# Altium schematic sheet Power Supply.SchDoc
size A
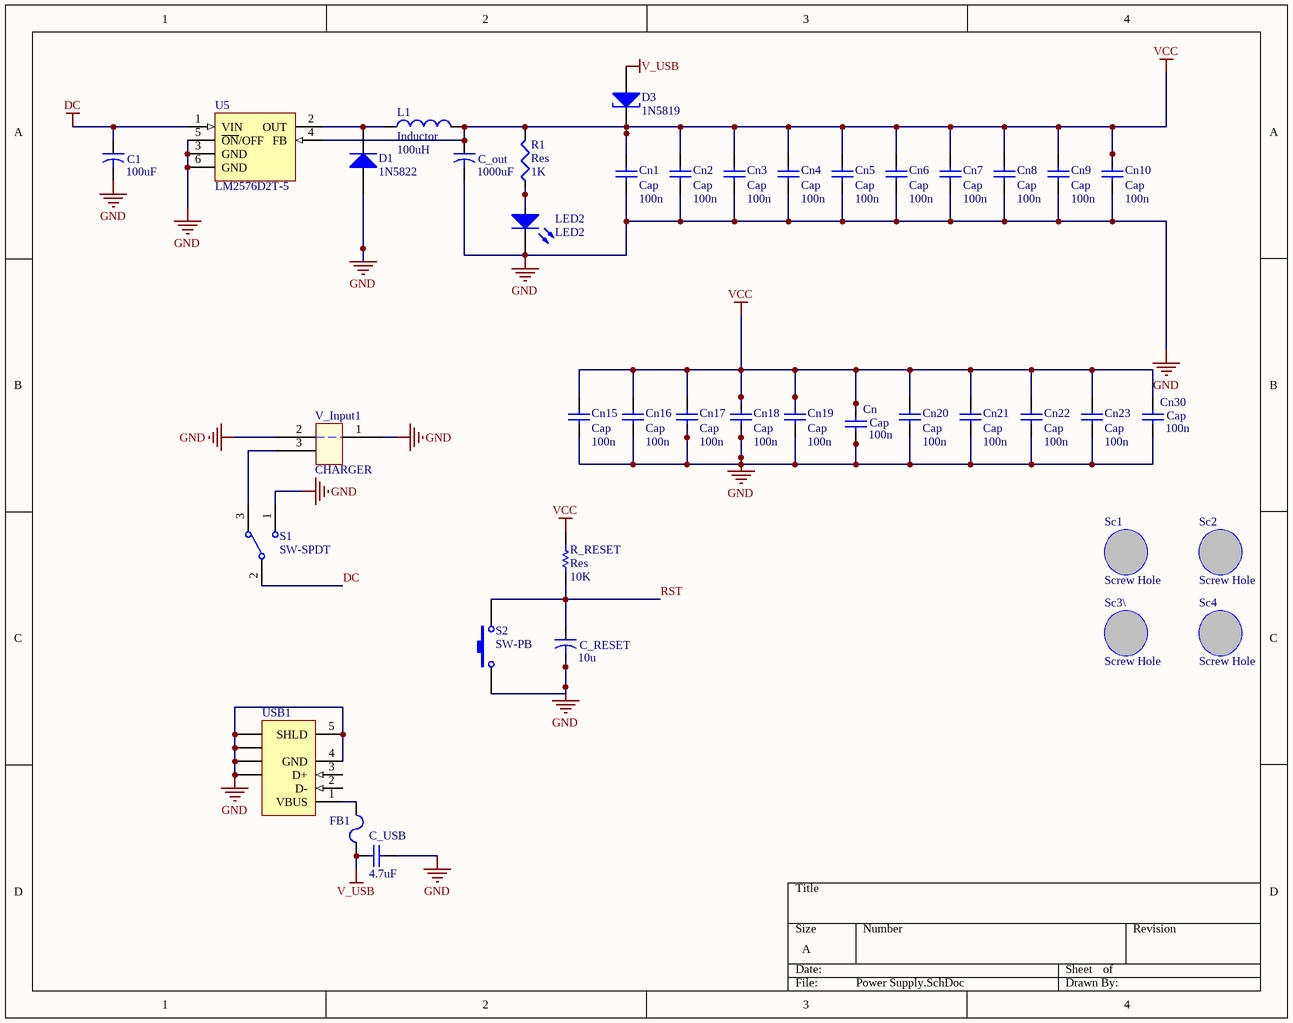
[diagram p0: Power Supply.SchDoc]

## Parts
C1  value 100uF  [CA1.5P]  (hidden comment: Cap_El)
C_out  value 1000uF  [CA1.5P]  (hidden comment: Cap_El)
C_RESET  value 10u  [CA1.5P]  (hidden comment: Cap_El)
C_USB  value 4.7uF  [2012[0805]]  (hidden comment: Cap_UP)
Cn  Cap  value 100n  [1608[0603]]
Cn1  Cap  value 100n  [1608[0603]]
Cn2  Cap  value 100n  [1608[0603]]
Cn3  Cap  value 100n  [1608[0603]]
Cn4  Cap  value 100n  [1608[0603]]
Cn5  Cap  value 100n  [1608[0603]]
Cn6  Cap  value 100n  [1608[0603]]
Cn7  Cap  value 100n  [1608[0603]]
Cn8  Cap  value 100n  [1608[0603]]
Cn9  Cap  value 100n  [1608[0603]]
Cn10  Cap  value 100n  [1608[0603]]
Cn15  Cap  value 100n  [1608[0603]]
Cn16  Cap  value 100n  [1608[0603]]
Cn17  Cap  value 100n  [1608[0603]]
Cn18  Cap  value 100n  [1608[0603]]
Cn19  Cap  value 100n  [1608[0603]]
Cn20  Cap  value 100n  [1608[0603]]
Cn21  Cap  value 100n  [1608[0603]]
Cn22  Cap  value 100n  [1608[0603]]
Cn23  Cap  value 100n  [1608[0603]]
Cn30  Cap  value 100n  [1608[0603]]
D1  1N5822  [US1M]
D3  1N5819  [us1m]
FB1  (no value)  [2012[0805]]
L1  Inductor  value 100uH  [AXIAL-0.3]
LED2  LED2  [3518]
R1  Res  value 1K  [1608[0603]]
R_RESET  Res  value 10K  [1608[0603]]
S1  SW-SPDT  [SW-SPDT]
S2  SW-PB  [SPST-2]
Sc1  Screw Hole  [Screw Holw 3-6 mm]
Sc2  Screw Hole  [Screw Holw 3-6 mm]
Sc3\  Screw Hole  [Screw Holw 3-6 mm]
Sc4  Screw Hole  [Screw Holw 3-6 mm]
U5  LM2576D2T-5  [936A-02]
USB1  (no value)  [USB_Mini]
V_Input1  CHARGER  [CHARGER]

## Nets
DC: C1.1 S1.2 U5.1(VIN)
GND: C1.2 C_out.2 C_RESET.2 C_USB.2 Cn.2 Cn1.1 Cn2.1 Cn3.1 Cn4.1 Cn5.1 Cn6.1 Cn7.1 Cn8.1 Cn9.1 Cn10.1 Cn15.1 Cn16.1 Cn17.1 Cn18.1 Cn19.1 Cn20.1 Cn21.1 Cn22.1 Cn23.1 Cn30.2 D1.1(A) LED2.2(K) S1.1 S2.1 U5.3(GND) U5.5(~{ON}/OFF) U5.6(GND) USB1.4(GND) USB1.5(SHLD) USB1.6(SHLD) USB1.7(SHLD) USB1.8(SHLD) USB1.9(SHLD) V_Input1.1 V_Input1.2
V_USB: C_USB.1 D3.2(A) FB1.2
VCC: C_out.1 Cn.1 Cn1.2 Cn2.2 Cn3.2 Cn4.2 Cn5.2 Cn6.2 Cn7.2 Cn8.2 Cn9.2 Cn10.2 Cn15.2 Cn16.2 Cn17.2 Cn18.2 Cn19.2 Cn20.2 Cn21.2 Cn22.2 Cn23.2 Cn30.1 D3.1(K) L1.2 R1.2 R_RESET.1 U5.4(FB)
RST: C_RESET.1 R_RESET.2 S2.2
NetD1_2: D1.2(K) L1.1 U5.2(OUT)
NetFB1_1: FB1.1 USB1.1(VBUS)
NetLED2_1: LED2.1(A) R1.1
NetS1_3: S1.3 V_Input1.3

Not connected (* = marked no-connect by the designer): USB1 2(D-) 3(D+)

## Library data of the parts
C1 C_out C_RESET = Cap_El: Capacitor; Published: 23-Sep-2002; PackageReference: CAPR5-4X5; Publisher: Altium Limited
C_USB Cn Cn30 = Cap_UP: Capacitor; Published: 8-Jun-2000; LatestRevisionDate: 17-Jul-2002; LatestRevisionNote: Re-released for DXP Platform.; PackageReference: RAD-0.3; Publisher: Altium Limited
Cn1-Cn10 Cn15-Cn23 = Cap: Capacitor; Published: 8-Jun-2000; LatestRevisionDate: 17-Jul-2002; LatestRevisionNote: Re-released for DXP Platform.; PackageReference: RAD-0.3; Publisher: Altium Limited; PackageDescription: Radial Cap, Thru-Hole; 2 Leads; 0.3 in Pin Spacing
D1 = Diode: 1 Amp General Purpose Rectifier; Revision 1: 11-Jul-2000: SIM Model Added.; Revision 2: 17-Jul-2002: Re-released for DXP Platform.; Package Information: Latest Revision: Aug-1999; Code - JEDEC: DO-204-AL; Published: 8-Jun-2000; Datasheet: Latest Revision: 1998; Package Reference: DO-41; Publisher: Altium Limited
D3 = Diode_ShotKey: 1 Amp General Purpose Rectifier; Revision 1: 11-Jul-2000: SIM Model Added.; Revision 2: 17-Jul-2002: Re-released for DXP Platform.; Package Information: Latest Revision: Aug-1999; Code - JEDEC: DO-204-AL; Published: 8-Jun-2000; Datasheet: Latest Revision: 1998; Package Reference: DO-41; Publisher: Altium Limited
FB1 = Ferrite Beed: Code_IEC: 1005; Published: 8-Jun-2000; LatestRevisionDate: 17-Jul-2002; LatestRevisionNote: Re-released for DXP Platform.; PackageReference: 0402-A; Publisher: Altium Limited; Code_JEITA: 0402
L1 = Inductor: Code_IEC: 1005; Published: 8-Jun-2000; LatestRevisionDate: 29-May-2009; LatestRevisionNote: IPC-7351 Footprint Added.; PackageReference: 0402-A; Publisher: Altium Limited; PackageDescription: Chip Inductor; Code_JEITA: 0402
LED2 = LED2: Typical RED, GREEN, YELLOW, AMBER GaAs LED; Published: 8-Jun-2000; LatestRevisionDate: 17-Jul-2002; LatestRevisionNote: Re-released for DXP Platform.; PackageVersion: Feb-2002; PackageReference: 3.2X1.6X1.1; Publisher: Altium Limited; PackageDescription: SM LED; 2 Flat Leads
R1 = Res3: Resistor; Published: 8-Jun-2000; LatestRevisionDate: 29-May-2009; LatestRevisionNote: IPC-7351 Footprint Added.; PackageReference: J1-0603; Publisher: Altium Limited; PackageDescription: Chip Resistor
R_RESET = Res: Semiconductor Resistor; Published: 8-Jun-2000; LatestRevisionDate: 17-Jul-2002; LatestRevisionNote: Re-released for DXP Platform.; PackageReference: AXIAL-0.5; Publisher: Altium Limited
S1 = SW-SPDT: SPDT Subminiature Toggle Switch, Right Angle Mounting, Vertical Actuation; Published: 24-Mar-1999; LatestRevisionDate: 17-Dec-2003; LatestRevisionNote: Schematic revised, PCB Footprint replaced.; DatasheetVersion: 05-Dec-2000; PackageReference: TL36WW15050; Publisher: Altium Limited; PackageDescription: Switch; 4 Leads; ComponentLink1Description: Manufacturer Link; ComponentLink1URL: http://www.apem.com
S2 = SW-PB: Switch; Published: 24-Mar-1999; LatestRevisionDate: 17-Jul-2002; LatestRevisionNote: Re-released for DXP Platform.; PackageReference: SPST-2; Publisher: Altium Limited; PackageDescription: Switch; 2 Leads
U5 = LM2576D2T-5: Easy Switcher 3.0A Step-Down Voltage Regulator; Note: Pin 3 is electrically connected to Pin 6;Pin 6 is heatsink; Published: 15-Apr-2002; DatasheetVersion: Jul-1999; PackageVersion: Jul-1999; PackageReference: 936A-02; Publisher: Altium Limited; PackageDescription: D2-PAK; 5 Leads; Body 14.7 (inc. leads) x 10.2 mm (LxW max); ComponentLink1Description: Manufacturer Link; ComponentLink1URL: http://www.onsemi.com/site/products/taxonomy/0,4438,503,00.html; ComponentLink2Description: Datasheet; ComponentLink2URL: http://www.onsemi.com/pub/Collateral/LM2576-D.PDF
USB1 = 440479-1: USB 2.0, Right Angle, SMT, AB Type, Receptacle, 5 Position, Black; ContactMaterial: Phosphor Bronze; ContactPlating: Gold (30) over Nickel; PCB_Layout: Complies with manufacturer's recommendation.; DrillSize: Corresponds to nominal value.; PanelGround: Without; Published: 15-Jul-2004; DatasheetDocument: 28-Jan-2003; PackageDocument: 28-Jan-2003; PackageReference: 440479; Publisher: Altium Limited; HousingMaterial: Thermoplastic; ComponentLink1Description: Manufacturer Link; ComponentLink1URL: http://www.tycoelectronics.com/; ComponentLink2Description: Packaging Specification; ComponentLink2URL: http://ecommas.tycoelectronics.com/commerce/DocumentDelivery/DDEController?Action=showdoc&DocId=Customer+Drawing%7F440479%7FD%7Fpdf%7FEnglish%7FC_440479_D.pdf